# Altium schematic sheet Bias_High.SchDoc
size A; SheetNumber: 2; SheetTotal: 9
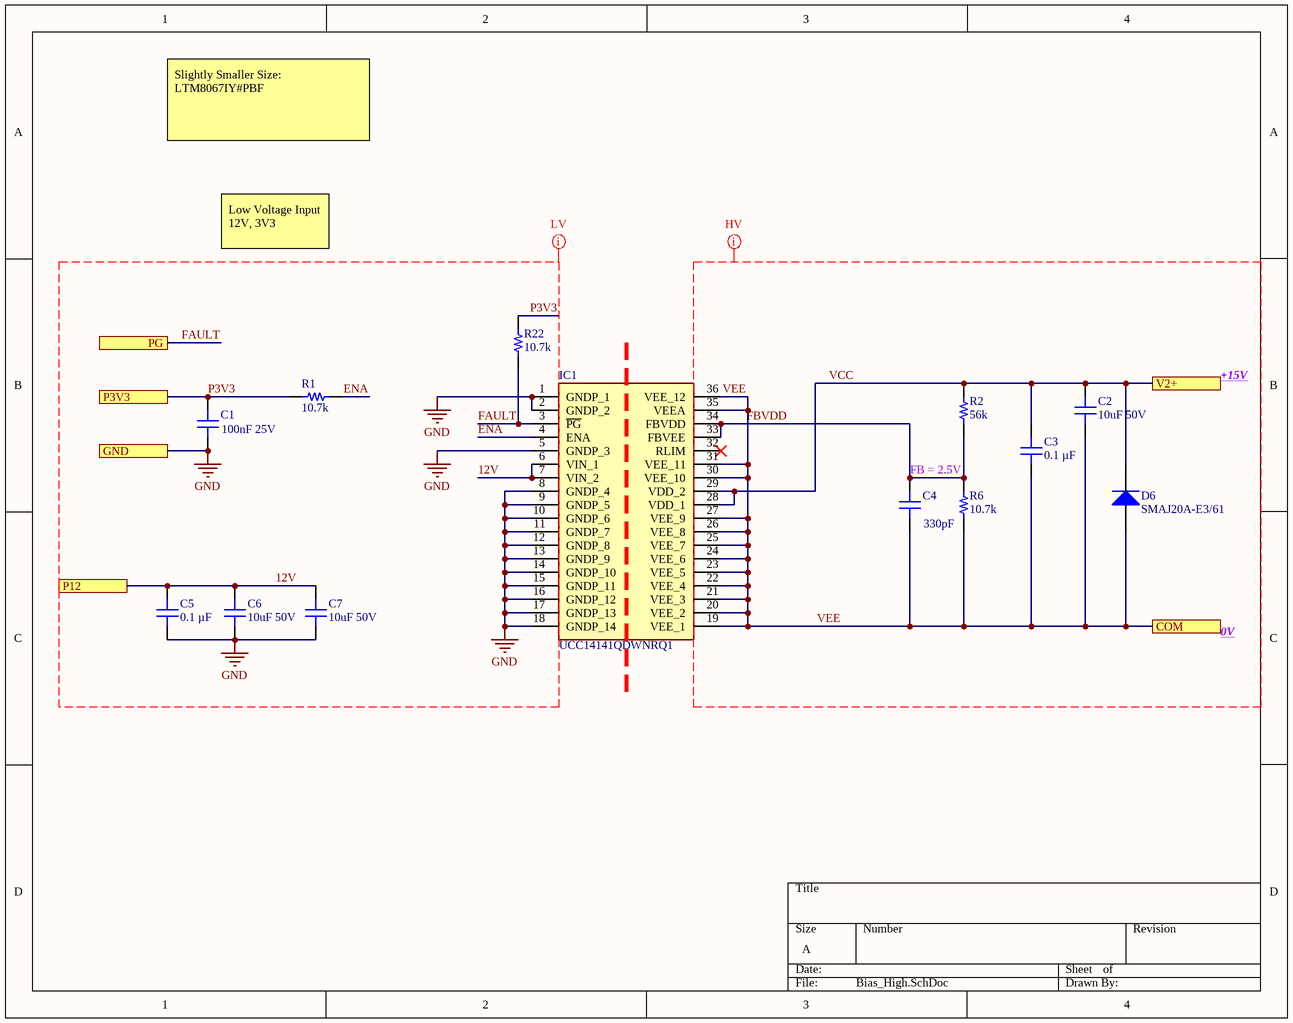
[diagram p0: Bias_High.SchDoc]

## Parts
C1  100nF 25V  [CAP 0402_1005]
C2  10uF 50V  [CAP 1210_3225 - 1MM]
C3  0.1 µF  [CAP 0603_1608]
C4  330pF  [CAP 0402_1005]
C5  0.1 µF  [CAP 0603_1608]
C6  10uF 50V  [CAP 1210_3225 - 1MM]
C7  10uF 50V  [CAP 1210_3225 - 1MM]
D6  SMAJ20A-E3/61  [VISH-DO-214AC-2_M]
IC1  UCC14141QDWNRQ1  [SOP65P1030X355-36N]
R1  10.7k  [RES 0402_1005]
R2  56k  [RES 0402_1005]
R6  10.7k  [RES 0402_1005]
R22  10.7k  [RES 0402_1005]

## Ports
COM, GND, P3V3, P12, PG, V2+

## Nets
GND: C1.1 C5.1 C6.2 C7.2 IC1.1(GNDP_1) IC1.2(GNDP_2) IC1.5(GNDP_3) IC1.8(GNDP_4) IC1.9(GNDP_5) IC1.10(GNDP_6) IC1.11(GNDP_7) IC1.12(GNDP_8) IC1.13(GNDP_9) IC1.14(GNDP_10) IC1.15(GNDP_11) IC1.16(GNDP_12) IC1.17(GNDP_13) IC1.18(GNDP_14) ; port GND
12V: C5.2 C6.1 C7.1 IC1.6(VIN_1) IC1.7(VIN_2) ; port P12
ENA: IC1.4(ENA) R1.1
FAULT: IC1.3(~{PG}) R22.2 ; port PG
FBVDD: C4.2 IC1.33(FBVEE) IC1.34(FBVDD) R2.1 R6.2
P3V3: C1.2 R1.2 R22.1 ; port P3V3
VCC: C2.1 C3.2 D6.1(K) IC1.28(VDD_1) IC1.29(VDD_2) R2.2 ; port V2+
VEE: C2.2 C3.1 C4.1 D6.2(A) IC1.19(VEE_1) IC1.20(VEE_2) IC1.21(VEE_3) IC1.22(VEE_4) IC1.23(VEE_5) IC1.24(VEE_6) IC1.25(VEE_7) IC1.26(VEE_8) IC1.27(VEE_9) IC1.30(VEE_10) IC1.31(VEE_11) IC1.35(VEEA) IC1.36(VEE_12) R6.1 ; port COM

Not connected (* = marked no-connect by the designer): IC1 32(RLIM)*

## Layout directives
net class HV: FBVDD, VCC, VEE
net class LV: 12V, ENA, FAULT, GND, P3V3

## Notes on the sheet
- Slightly Smaller Size: LTM8067IY#PBF
- Low Voltage Input
  12V, 3V3
- +15V
- FB = 2.5V
- 0V

## Library data of the parts
C1 C4 = ZRB15XR60J106ME12D: CAP CER 10UF 6.3V X5R 0402; manufacturer: Murata Electronics; Capacitance: 10 µF; Tolerance: ±20%; value: 10 µF; Part Number: ZRB15XR60J106ME12D; Applications: Acoustic Noise Reduction; componentlink1description: Datasheet; componentlink1url: https://psearch.en.murata.com/capacitor/product/ZRB15XR60J106ME12%23.pdf; componentlink2description: DigiKey Link; componentlink2url: https://www.digikey.com/en/products/detail/murata-electronics/ZRB15XR60J106ME12D/5877414; Device Package: 0402 (1005 Metric); Features: Interposer Termination; lastupdated: 2/9/2024 8:04:31 PM; Lifecycle Status: Active; Minimum Order: 1; Mounting Type: Surface Mount, MLCC; Operating Temperature: -55°C ~ 85°C; Package / Case: 0402 (1005 Metric); packaging: TapeAndReel; partid: 6019; Part Status: Active; price: 0.03; series: ZRB; Size / Dimension: 0.039" L x 0.020" W (1.00mm x 0.50mm); Supplier 1: DigiKey; Supplier Part Number 1: 490-13251-1-ND; Temperature Coefficient: X5R; Thickness (Max): 0.031" (0.80mm); Voltage - Rated: 6.3V
C2 C6 C7 = MSAST32NSB5106MTNA01: CAP CER 10UF 25V X5R 1210; manufacturer: Taiyo Yuden; Value: 10 µF; Tolerance: ±20%; Part Number: MSAST32NSB5106MTNA01; Applications: SMPS Filtering; Capacitance: 10 µF; componentlink1description: Datasheet; componentlink1url: https://mm.digikey.com/Volume0/opasdata/d220001/medias/docus/5731/MSR01_e.pdf; componentlink2description: DigiKey Link; componentlink2url: https://www.digikey.com/en/products/detail/taiyo-yuden/MSAST32NSB5106MTNA01/16661899; Device Package: 1210 (3225 Metric); lastupdated: 6/4/2024 7:20:40 PM; Lifecycle Status: Active; Minimum Order: 1; Mounting Type: Surface Mount, MLCC; Operating Temperature: -55°C ~ 85°C; Package / Case: 1210 (3225 Metric); packaging: TapeAndReel; partid: 58126; price: 0.08; series: MSAS; Size / Dimension: 0.126" L x 0.098" W (3.20mm x 2.50mm); Supplier 1: DigiKey; Supplier Part Number 1: 587-MSAST32NSB5106MTNA01CT-ND; Temperature Coefficient: X5R; Thickness (Max): 0.083" (2.10mm); Voltage - Rated: 25V
C3 C5 = C0603C104K5RAC7411: CAP CER 0.1UF 50V X7R 0603; manufacturer: KEMET; Tolerance: ±10%; Part Number: C0603C104K5RAC7411; Capacitance: 0.1 µF; Applications: Bypass, Decoupling; componentlink1description: Datasheet; componentlink1url: https://api.kemet.com/component-edge/download/datasheet/C0603C104K5RAC7411.pdf; componentlink2description: DigiKey Link; componentlink2url: https://www.digikey.com/en/products/detail/kemet/C0603C104K5RAC7411/3317013; Device Package: 0603 (1608 Metric); lastupdated: 2/9/2024 8:10:30 PM; Lifecycle Status: Active; Minimum Order: 1; Mounting Type: Surface Mount, MLCC; Operating Temperature: -55°C ~ 125°C; Package / Case: 0603 (1608 Metric); packaging: TapeAndReel; partid: 2233; Part Status: Active; price: 0.01; series: SMD Comm X7R; Size / Dimension: 0.063" L x 0.031" W (1.60mm x 0.80mm); Supplier 1: DigiKey; Supplier Part Number 1: 399-C0603C104K5RAC7411CT-ND; Temperature Coefficient: X7R; Thickness (Max): 0.035" (0.90mm); value: 0.1 µF; Voltage - Rated: 50V
D6 = CMP-0548-00226-2: Transient Voltage Suppressor, 6.40 to 231 V, 20 V Stand-off Voltage, Uni-Directional, -55 to 155 degC, 2-pin DO-214AC, Pb-Free, Tape and Reel; Manufacturer: Vishay Semiconductor; IFSM: 40 A; VWM (V): 20; PPPM (W): 400, 300; ID (uA): 1; VBR Uni-Directional (V): 6.4 to 231; PackageReference: DO-214AC-2; ComponentLink2URL: http://www.vishay.com/docs/88390/smaj50a.pdf; ComponentLink3Description: Package Specification; ComponentLink3URL: http://www.vishay.com/docs/88390/smaj50a.pdf; Mounting Technology: Surface Mount; Packing: Tape and Reel; PackageDescription: 2-Pin DO-214AC (SMA), Body 4.245 x 2.665 mm; PartNumber: SMAJ20A-E3/61; ComponentLink2Description: Datasheet; DatasheetVersion: 12/8/2013; Operating Junction and Storage Temperature Range: -55 to 150 degC; ComponentLink1URL: http://www.vishay.com/; ComponentLink1Description: Manufacturer URL; RoHS: TRUE
IC1 = UCC14141QDWNRQ1: Integrated Circuit; Manufacturer_Name: Texas Instruments; Datasheet Link: https://www.ti.com/lit/ds/symlink/ucc14141-q1.pdf?ts=1698771279569&ref_url=https%253A%252F%252Fwww.ti.com%252Fsitesearch%252Fen-us%252Fdocs%252Funiversalsearch.tsp%253FlangPref%253Den-US%2526searchTerm%253DUCC14141QDWNRQ1%2526nr%253D3; Height: 3.55mm; Manufacturer_Part_Number: UCC14141QDWNRQ1; Mouser Part Number: 595-UCC14141QDWNRQ1; Mouser Price/Stock: https://www.mouser.co.uk/ProductDetail/Texas-Instruments/UCC14141QDWNRQ1?qs=HoCaDK9Nz5fMbqXhrb3e4A%3D%3D; Arrow Part Number: UCC14141QDWNRQ1; Arrow Price/Stock: https://www.arrow.com/en/products/ucc14141qdwnrq1/texas-instruments?utm_currency=USD&region=nac
R1 R2 R6 R22 = RP73PF1E249KBTD: RES 249K OHM 0.1% 1/10W 0402; Manufacturer: TE Connectivity Passive Product; Value: 249 kOhms; Power (Watts): 0.1W, 1/10W; Temperature Coefficient: ±25ppm/°C; Part Number: RP73PF1E249KBTD; ComponentLink1Description: Datasheet; ComponentLink1URL: https://www.te.com/commerce/DocumentDelivery/DDEController?Action=srchrtrv&DocNm=1773272&DocType=DS&DocLang=English; ComponentLink2Description: DigiKey Link; ComponentLink2URL: https://www.digikey.com/en/products/detail/te-connectivity-passive-product/RP73PF1E249KBTD/8261091; Composition: Thin Film; Device Package: 0402 (1005 Metric); Height - Seated (Max): 0.014" (0.35mm); LastUpdated: 2/9/2024 8:30:24 PM; Lifecycle Status: Active; Minimum Order: 1; Number of Terminations: 2; Operating Temperature: -55°C ~ 155°C; Package / Case: 0402 (1005 Metric); Packaging: TapeAndReel; PartId: 2418; Part Status: Active; Price: 0.07; Resistance: 249 kOhms; Series: RP73, Holsworthy; Size / Dimension: 0.039" L x 0.020" W (1.00mm x 0.50mm); Supplier 1: DigiKey; Supplier Part Number 1: A127549CT-ND; Supplier Device Package: 0402; Tolerance: ±0.1%